# Altium project ByggernPCB.PrjPcb
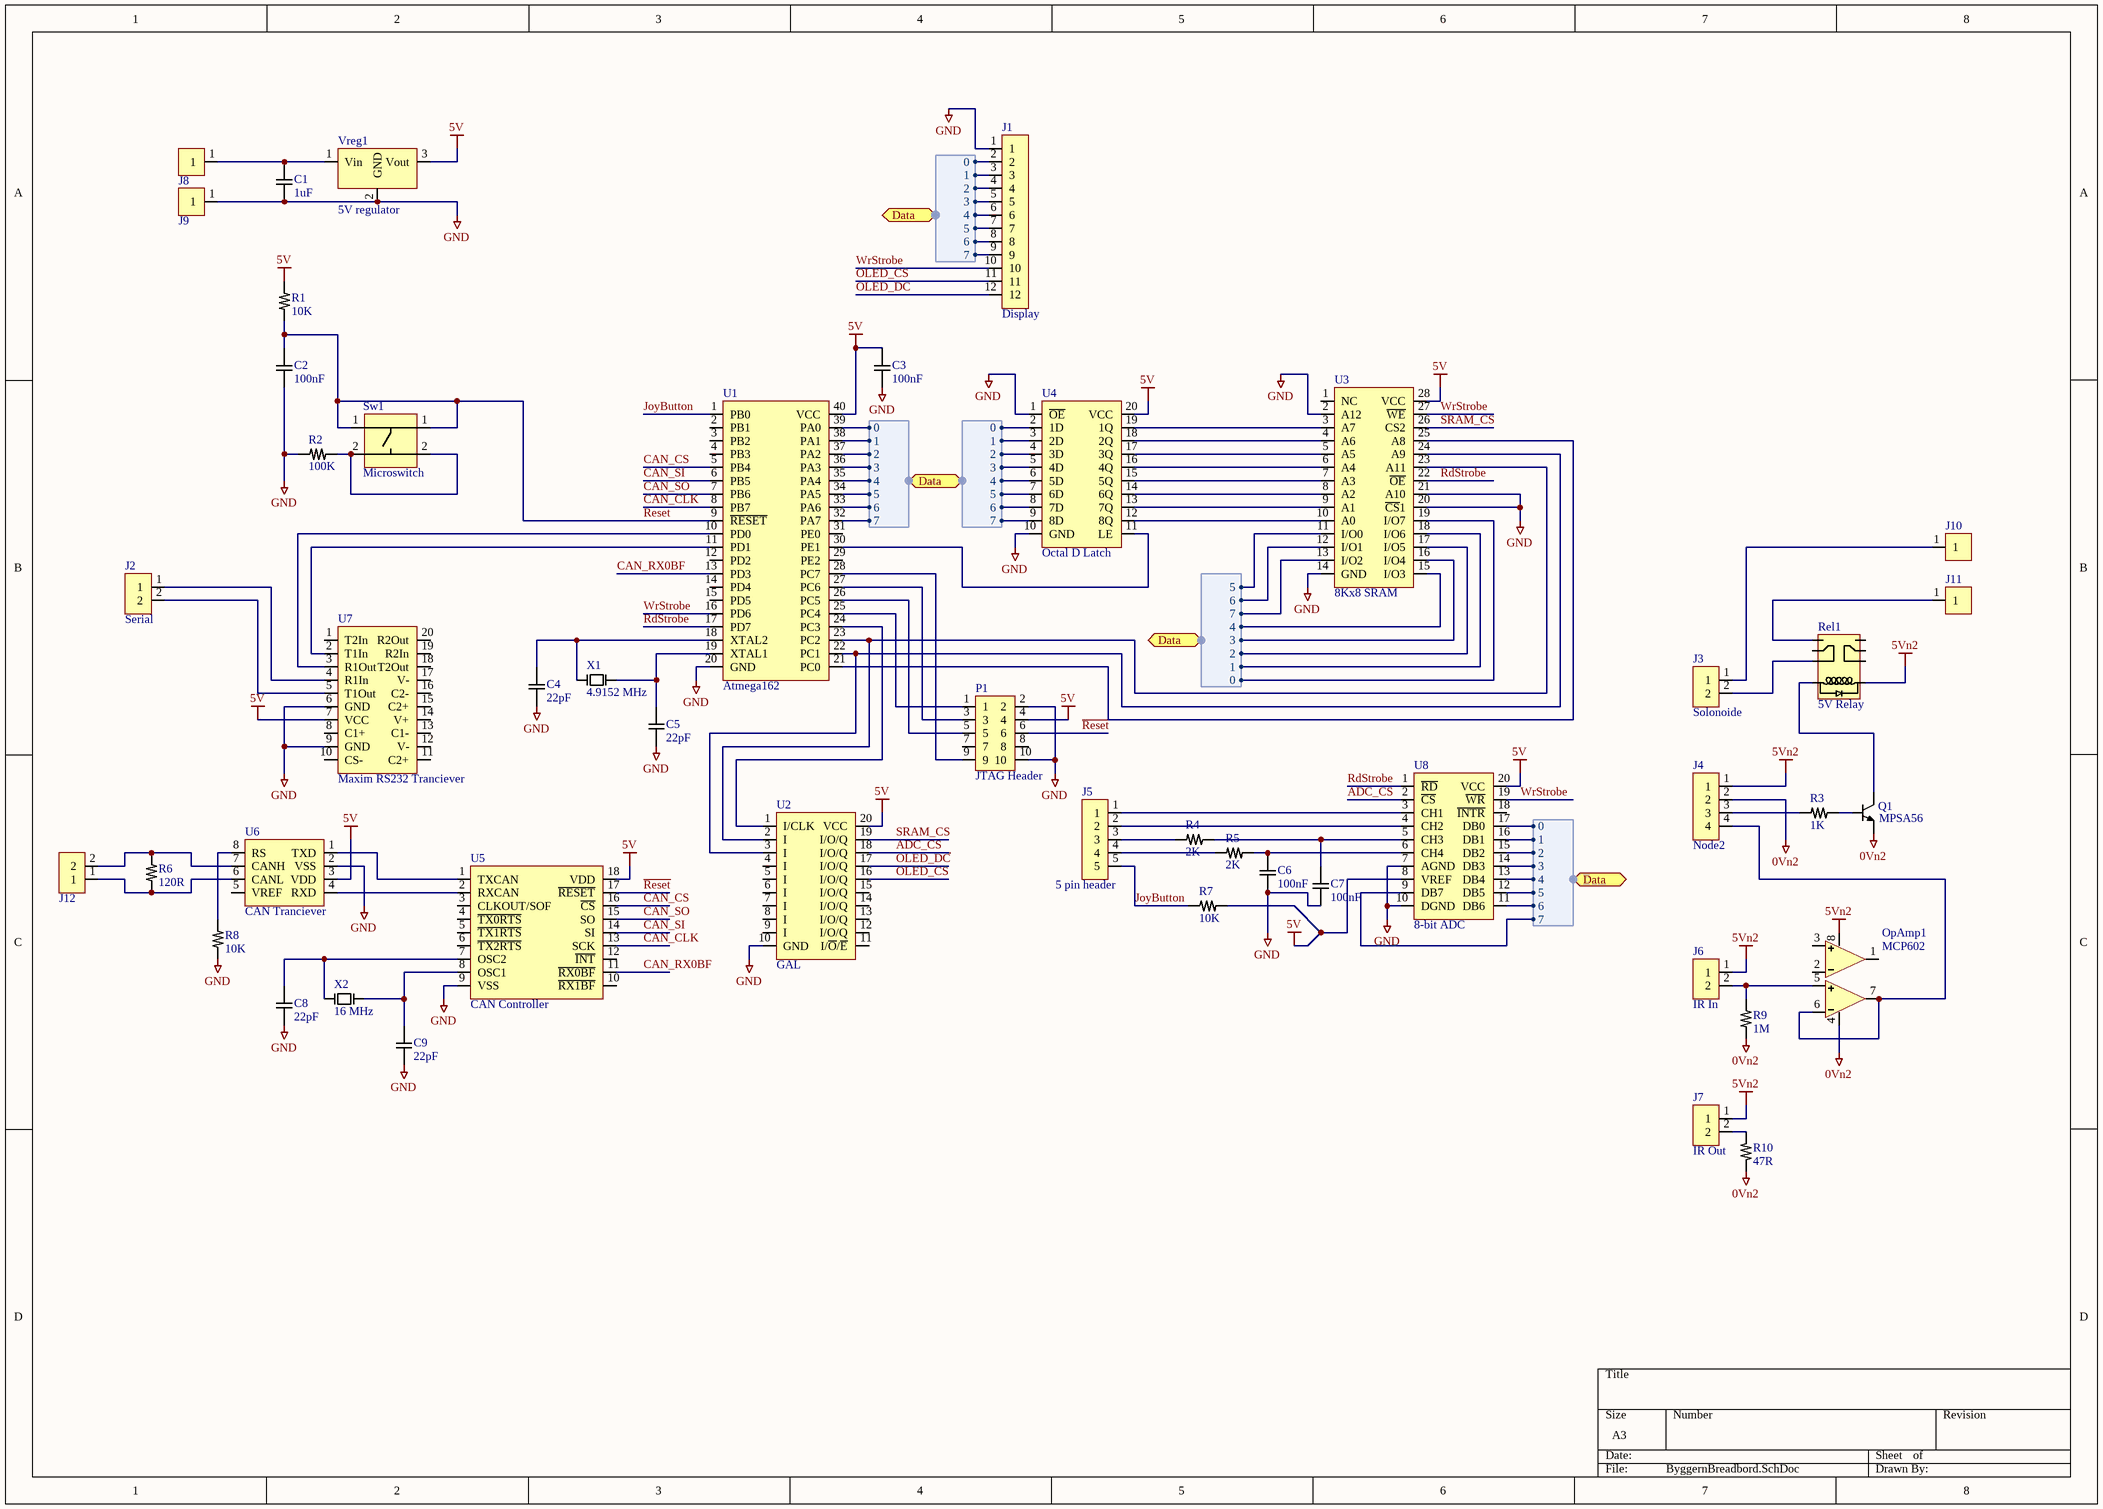
[diagram p0: ByggernBreadbord.SchDoc]
1 sheet, 47 parts. Net scope: flat (ports and power ports of the same name join across sheets).
Board file: ByggernPCB_R01.PcbDoc

## Sheet ByggernBreadbord.SchDoc
size A3

### Parts
C1  1uF  [Capacitor]
C2  100nF  [Capacitor]
C3  100nF  [Capacitor]
C4  22pF  [Capacitor]
C5  22pF  [Capacitor]
C6  100nF  [Capacitor]
C7  100nF  [Capacitor]
C8  22pF  [Capacitor]
C9  22pF  [Capacitor]
J1  Display  [Header12]
J2  Serial  [Header2]
J3  Solonoide  [Header2]
J4  Node2  [Header4]
J5  5 pin header  [Header5]
J6  IR In  [Header2]
J7  IR Out  [Header2]
J8  Banana  [Banana-plug]  (value not drawn)
J9  Banana  [Banana-plug]  (value not drawn)
J10  Banana  [Banana-plug]  (value not drawn)
J11  Banana  [Banana-plug]  (value not drawn)
J12  Screw-terminal  [Screw connector]  (value not drawn)
OpAmp1  MCP602  [DIP8]
P1  JTAG Header  [Header5x2]
Q1  MPSA56  [SIP3]
R1  10K  [Axial 0.6]
R2  100K  [Axial 0.6]
R3  1K  [Axial 0.6]
R4  2K  [Axial 0.6]
R5  2K  [Axial 0.6]
R6  120R  [Axial 0.6]
R7  10K  [Axial 0.6]
R8  10K  [Axial 0.6]
R9  1M  [Axial 0.6]
R10  47R  [Axial 0.6]
Rel1  5V Relay  [DIP16-8]
Sw1  Microswitch  [Microswitch]
U1  Atmega162  [DIP40]
U2  GAL  [DIP20]
U3  8Kx8 SRAM  [DIP28]
U4  Octal D Latch  [DIP20]
U5  CAN Controller  [DIP18]
U6  CAN Tranciever  [DIP8]
U7  Maxim RS232 Tranciever  [DIP20]
U8  8-bit ADC  [DIP20]
Vreg1  5V regulator  [SIP3]
X1  4.9152 MHz  [Crystal]
X2  16 MHz  [Crystal]

### Ports
Data (harness Data)

### Harnesses
Data: 0, 1, 2, 3, 4, 5, 6, 7
Data: 4, 3, 2, 1, 0, 5, 6, 7

### Nets
0Vn2: J4.2 OpAmp1.4(Vss) Q1.3 R9.2 R10.1
5V: C3.1 P1.4 R1.1 R7.2 U1.40(VCC) U2.20(VCC) U3.28(VCC) U4.20(VCC) U5.18(VDD) U6.3(VDD) U7.7(VCC) U8.8(VREF) U8.20(VCC) Vreg1.3(Vout)
5Vn2: J4.1 J6.1 J7.1 OpAmp1.8(Vdd) Rel1.5
GND: C1.2 C2.2 C3.2 C4.2 C5.2 C6.2 C7.2 C8.2 C9.2 J1.1 J9.1 P1.2 P1.10 R2.1 R8.2 U1.20(GND) U2.10(GND) U3.2(A12) U3.14(GND) U3.20(~{CS}1) U3.21(A10) U4.1(~{OE}) U4.10(GND) U5.9(VSS) U6.2(VSS) U7.6(GND) U7.9(GND) U8.7(AGND) U8.10(DGND) Vreg1.2(GND)
ADC_CS: U2.18(I/O/Q) U8.2(~{CS})
CAN_CLK: U1.8(PB7) U5.13(SCK)
CAN_CS: U1.5(PB4) U5.16(~{CS})
CAN_RX0BF: U1.13(PD3) U5.11(~{RX0BF})
CAN_SI: U1.6(PB5) U5.14(SI)
CAN_SO: U1.7(PB6) U5.15(SO)
JoyButton: J5.5 R7.1 U1.1(PB0)
OLED_CS: J1.11 U2.16(I/O/Q)
OLED_D~{C}: J1.12 U2.17(I/O/Q)
~{Reset}: C2.1 P1.6 R1.2 Sw1.1 U1.9(~{RESET}) U5.17(~{RESET})
RdStrobe: U1.17(PD7) U3.22(~{OE}) U8.1(~{RD})
SRAM_CS: U2.19(I/O/Q) U3.26(CS2)
WrStrobe: J1.10 U1.16(PD6) U3.27(~{WE}) U8.19(~{WR})
NetC1_1: C1.1 J8.1 Vreg1.1(Vin)
NetC4_1: C4.1 U1.18(XTAL2) X1.1
NetC5_1: C5.1 U1.19(XTAL1) X1.2
NetC6_1: C6.1 R5.2 U8.6(CH4)
NetC7_1: C7.1 R4.2 U8.5(CH3)
NetC8_1: C8.1 U5.7(OSC2) X2.1
NetC9_1: C9.1 U5.8(OSC1) X2.2
NetJ1_2: J1.2 U1.39(PA0) U3.19(I/O7) U4.2(1D) U8.17(DB0) ; port Data.0
NetJ1_3: J1.3 U1.38(PA1) U3.18(I/O6) U4.3(2D) U8.16(DB1) ; port Data.1
NetJ1_4: J1.4 U1.37(PA2) U3.17(I/O5) U4.4(3D) U8.15(DB2) ; port Data.2
NetJ1_5: J1.5 U1.36(PA3) U3.16(I/O4) U4.5(4D) U8.14(DB3) ; port Data.3
NetJ1_6: J1.6 U1.35(PA4) U3.15(I/O3) U4.6(5D) U8.13(DB4) ; port Data.4
NetJ1_7: J1.7 U1.34(PA5) U3.11(I/O0) U4.7(6D) U8.12(DB5) ; port Data.5
NetJ1_8: J1.8 U1.33(PA6) U3.12(I/O1) U4.8(7D) U8.11(DB6) ; port Data.6
NetJ1_9: J1.9 U1.32(PA7) U3.13(I/O2) U4.9(8D) U8.9(DB7) ; port Data.7
NetJ2_1: J2.1 U7.4(R1In)
NetJ2_2: J2.2 U7.5(T1Out)
NetJ3_1: J3.1 J10.1
NetJ3_2: J3.2 Rel1.3
NetJ4_3: J4.3 R3.1
NetJ4_4: J4.4 OpAmp1.6(VINB-) OpAmp1.7(VOUTB)
NetJ5_1: J5.1 U8.3(CH1)
NetJ5_2: J5.2 U8.4(CH2)
NetJ5_3: J5.3 R4.1
NetJ5_4: J5.4 R5.1
NetJ6_2: J6.2 OpAmp1.5(VINB+) R9.1
NetJ7_2: J7.2 R10.2
NetJ11_1: J11.1 Rel1.1
NetJ12_1: J12.1 R6.2 U6.6(CANL)
NetJ12_2: J12.2 R6.1 U6.7(CANH)
NetP1_1: P1.1 U1.25(PC4)
NetP1_3: P1.3 U1.27(PC6)
NetP1_5: P1.5 U1.26(PC5)
NetP1_9: P1.9 U1.28(PC7)
NetQ1_1: Q1.1 Rel1.4
NetQ1_2: Q1.2 R3.2
NetR2_2: R2.2 Sw1.2
NetR8_1: R8.1 U6.8(RS)
NetU1_10: U1.10(PD0) U7.3(R1Out)
NetU1_11: U1.11(PD1) U7.2(T1In)
NetU1_21: U1.21(PC0) U3.25(A8)
NetU1_22: U1.22(PC1) U2.3(I) U3.24(A9)
NetU1_23: U1.23(PC2) U2.2(I) U3.23(A11)
NetU1_24: U1.24(PC3) U2.1(I/CLK)
NetU1_30: U1.30(PE1) U4.11(LE)
NetU3_3: U3.3(A7) U4.19(1Q)
NetU3_4: U3.4(A6) U4.18(2Q)
NetU3_5: U3.5(A5) U4.17(3Q)
NetU3_6: U3.6(A4) U4.16(4Q)
NetU3_7: U3.7(A3) U4.15(5Q)
NetU3_8: U3.8(A2) U4.14(6Q)
NetU3_9: U3.9(A1) U4.13(7Q)
NetU3_10: U3.10(A0) U4.12(8Q)
NetU5_1: U5.1(TXCAN) U6.1(TXD)
NetU5_2: U5.2(RXCAN) U6.4(RXD)

Not connected (* = marked no-connect by the designer): OpAmp1 1(VOUTA) 2(VINA-) 3(VINA+); P1 7 8; Rel1 2 6 7 8; U1 2(PB1) 3(PB2) 4(PB3) 12(PD2) 14(PD4) 15(PD5) 29(PE2) 31(PE0); U2 4(I) 5(I) 6(I) 7(I) 8(I) 9(I) 11(I/~{O}/~{E}) 12(I/O/Q) 13(I/O/Q) 14(I/O/Q) 15(I/O/Q); U3 1(NC); U5 3(CLKOUT/SOF) 4(~{TX0RTS}) 5(~{TX1RTS}) 6(~{TX2RTS}) 10(~{RX1BF}) 12(~{INT}); U6 5(VREF); U7 1(T2In) 8(C1+) 10(CS-) 11(C2+) 12(V-) 13(C1-) 14(V+) 15(C2+) 16(C2-) 17(V-) 18(T2Out) 19(R2In) 20(R2Out); U8 18(~{INTR})

### Library data of the parts
C1-C9 = GenericCapacitor
J1 = Header12
J2 J3 J6 J7 = Header2
J4 = Header4
J5 = Header5
R1-R10 = GenericResistor
Rel1 = Relay
U2 = GAL16V8
U3 = IDT_7164SL
U4 = SN74ALS573C
U5 = MCP2515
U6 = MCP2551
U7 = MAX233
U8 = ADC0844CCN
Vreg1 = MC7805
X1 X2 = GenericCrystal